# Altium schematic sheet imxbbnet.SchDoc: IMXBB
size A3; DocumentNumber: 8; Revision: 2.0; SheetNumber: 8; SheetTotal: 9
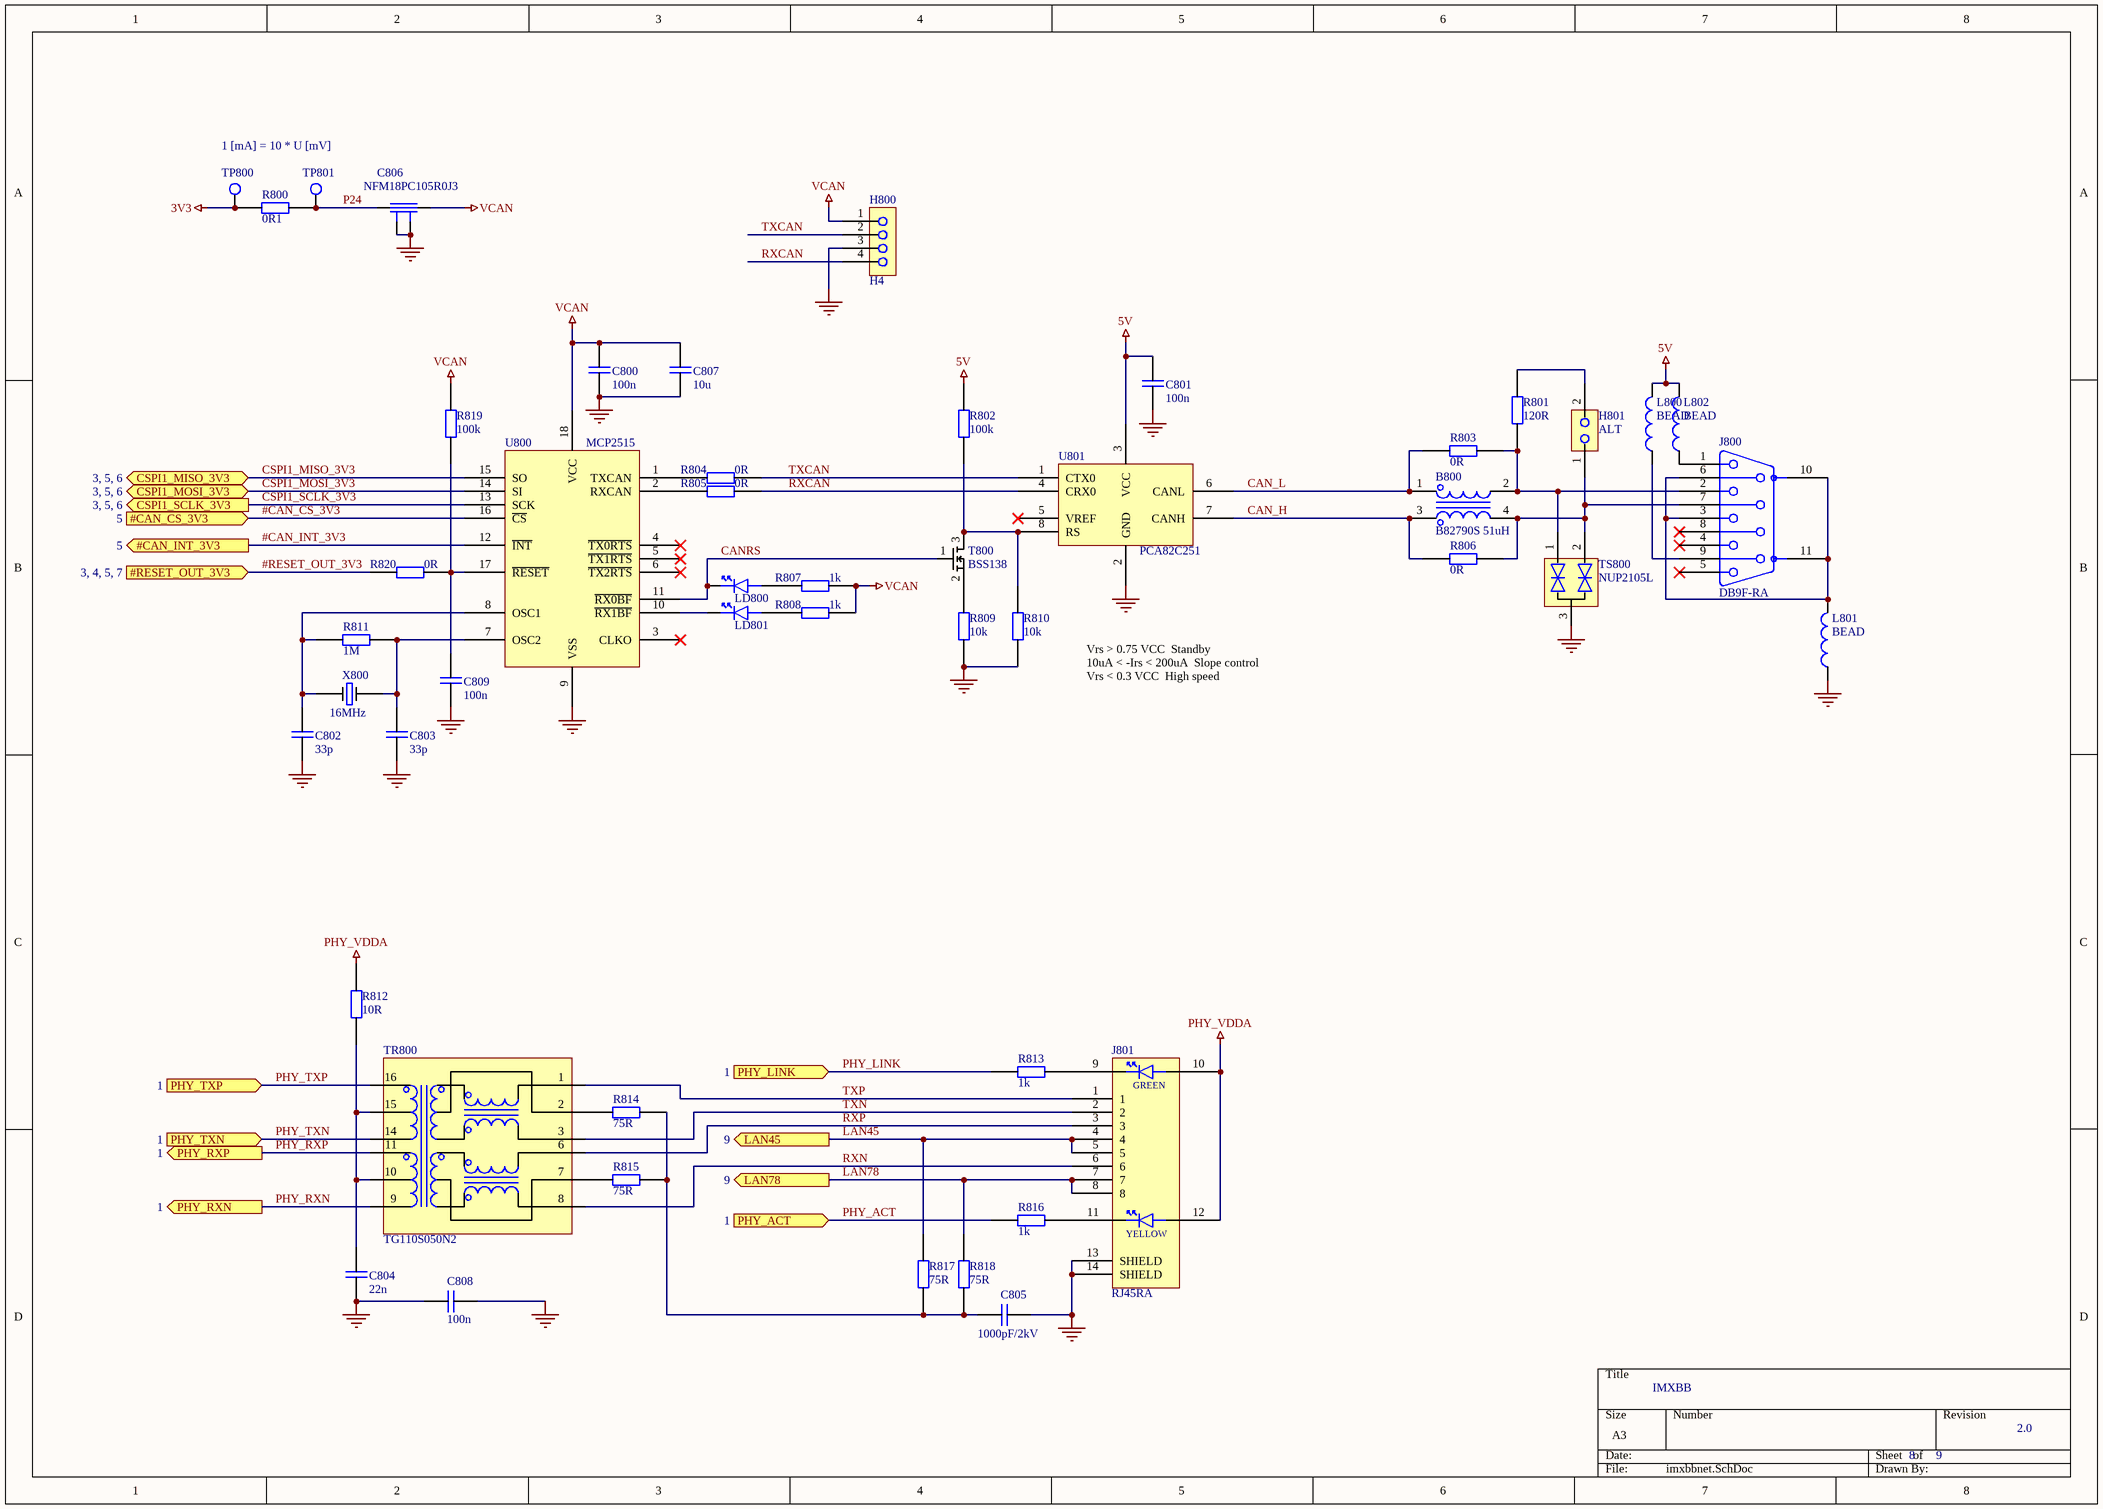
[diagram p0: imxbbnet.SchDoc]

## Parts
B800  B82790S 51uH  [B82790]
C800  100n  [0603]
C801  100n  [0603]
C802  33p  [0603]
C803  33p  [0603]
C804  22n  [0603]
C805  1000pF/2kV  [1n]
C806  NFM18PC105R0J3  [NFM18P]
C807  10u  [0805]
C808  100n  [0603]
C809  100n  [0603]
H800  H4  [H1x4]
H801  ALT  [H1x2]
J800  DB9F-RA  [DRA9_F]
J801  RJ45RA  [RJ45LED]
L800  BEAD  [0805]
L801  BEAD  [0603]
L802  BEAD  [0805]
LD800  LED  [0805]  (value not drawn)
LD801  LED  [0805]  (value not drawn)
R800  0R1  [0603]
R801  120R  [0603]
R802  100k  [0603]
R803  0R  [0603]
R804  0R  [0603]
R805  0R  [0603]
R806  0R  [0603]
R807  1k  [0603]
R808  1k  [0603]
R809  10k  [0603]
R810  10k  [0603]
R811  1M  [0603]
R812  10R  [0603]
R813  1k  [0603]
R814  75R  [0603]
R815  75R  [0603]
R816  1k  [0603]
R817  75R  [0603]
R818  75R  [0603]
R819  100k  [0603]
R820  0R  [0603]
T800  BSS138  [SOT23]
TP800  TESTPOINT  [TESTPOINT_2mm]  (value not drawn)
TP801  TESTPOINT  [TESTPOINT_2mm]  (value not drawn)
TR800  TG110S050N2  [SOIC16M]
TS800  NUP2105L  [SOT23]
U800  MCP2515  [SOIC18W]
U801  PCA82C251  [SOIC8N]
X800  16MHz  [HC494H]

## Ports
#CAN_CS_3V3 (in, see 5), #CAN_INT_3V3 (out, see 5), #RESET_OUT_3V3 (in, see 3, 4, 5, 7), CSPI1_MISO_3V3 (bidir, see 3, 5, 6), CSPI1_MOSI_3V3 (bidir, see 3, 5, 6), CSPI1_SCLK_3V3 (out, see 3, 5, 6), LAN45 (out, see 9), LAN78 (out, see 9), PHY_ACT (in, see 1), PHY_LINK (in, see 1), PHY_RXN (out, see 1), PHY_RXP (out, see 1), PHY_TXN (in, see 1), PHY_TXP (in, see 1)

## Nets
3V3: R800.1 TP800.1
5V: C801.2 L800.2 L802.2 R802.1 U801.3(VCC)
CASE_GND: C805.2 C808.1 J801.13(SHIELD) J801.14(SHIELD)
GND: C800.1 C801.1 C802.1 C803.1 C804.1 C806.2 C806.4 C807.1 C808.2 C809.1 H800.3 L801.1 R809.2 R810.2 TS800.3 U800.9(VSS) U801.2(GND)
PHY_VDDA: J801.10(D1P) J801.12(D2P) R812.2
VCAN: C800.2 C806.3 C807.2 H800.1 R807.1 R808.1 R819.1 U800.18(VCC)
#CAN_CS_3V3: U800.16(~{CS}) ; port #CAN_CS_3V3
#CAN_INT_3V3: U800.12(~{INT}) ; port #CAN_INT_3V3
#RESET_OUT_3V3: R820.2 ; port #RESET_OUT_3V3
CAN_H: B800.3 R806.1 U801.7(CANH)
CAN_L: B800.1 R803.1 U801.6(CANL)
CANRS: LD800.2(CATHODE) T800.1(G) U800.11(~{RX0BF})
CSPI1_MISO_3V3: U800.15(SO) ; port CSPI1_MISO_3V3
CSPI1_MOSI_3V3: U800.14(SI) ; port CSPI1_MOSI_3V3
CSPI1_SCLK_3V3: U800.13(SCK) ; port CSPI1_SCLK_3V3
LAN45: J801.4 J801.5 R817.2 ; port LAN45
LAN78: J801.7 J801.8 R818.2 ; port LAN78
P24: C806.1 R800.2 TP801.1
PHY_ACT: R816.1 ; port PHY_ACT
PHY_LINK: R813.1 ; port PHY_LINK
PHY_RXN: TR800.9(P10) ; port PHY_RXN
PHY_RXP: TR800.11(P12) ; port PHY_RXP
PHY_TXN: TR800.14(P14) ; port PHY_TXN
PHY_TXP: TR800.16(P16) ; port PHY_TXP
RXCAN: H800.4 R805.1 U801.4(CRX0)
RXN: J801.6 TR800.8(P8)
RXP: J801.3 TR800.6(P6)
TXCAN: H800.2 R804.1 U801.1(CTX0)
TXN: J801.2 TR800.3(P3)
TXP: J801.1 TR800.1(P1)
NetB800_2: B800.2 J800.2 R801.2 R803.2 TS800.1
NetB800_4: B800.4 H801.1 J800.7 R806.2 TS800.2
NetC802_2: C802.2 R811.2 U800.8(OSC1) X800.1
NetC803_2: C803.2 R811.1 U800.7(OSC2) X800.2
NetC804_2: C804.2 R812.1 TR800.10(P11) TR800.15(CT)
NetC805_1: C805.1 R814.2 R815.2 R817.1 R818.1
NetC809_2: C809.2 R819.2 R820.1 U800.17(~{RESET})
NetH801_2: H801.2 R801.1
NetJ800_1: J800.1 L802.1
NetJ800_3: J800.3 J800.6 J800.10(SHIELD) J800.11(SHIELD) L801.2
NetJ800_9: J800.9 L800.1
NetJ801_9: J801.9(D1N) R813.2
NetJ801_11: J801.11(D2N) R816.2
NetLD800_1: LD800.1(ANODE) R807.2
NetLD801_1: LD801.1(ANODE) R808.2
NetLD801_2: LD801.2(CATHODE) U800.10(~{RX1BF})
NetR802_2: R802.2 R810.1 T800.3(D) U801.8(RS)
NetR804_2: R804.2 U800.1(TXCAN)
NetR805_2: R805.2 U800.2(RXCAN)
NetR809_1: R809.1 T800.2(S)
NetR814_1: R814.1 TR800.2(P2)
NetR815_1: R815.1 TR800.7(P7)

Not connected (* = marked no-connect by the designer): J800 4* 5* 8*; U800 3(CLKO)* 4(~{TX0RTS})* 5(~{TX1RTS})* 6(~{TX2RTS})*; U801 5(VREF)*

## Notes on the sheet
- 1 [mA] = 10 * U [mV]
- Vrs > 0.75 VCC		Standby
  10uA < -Irs < 200uA		Slope control
  Vrs < 0.3 VCC		High speed
- (in symbol RJ45RA) GREEN; YELLOW

## Library data of the parts
B800 = B82790S: pin to pad: 3>4 4>3
C800-C805 C807-C809 = C
C806 = NFL21S: Chip EMIFIL; Producer: Murata; Order number: NFM18PC105R0J3; Component class: C; Assembly type: SMT
H801 = H2
L800-L802 = FBEAD
R800-R820 = R
TP800 TP801 = TESTPOINT: Testpoint pad; Order number: no component; Component class: TP; Producer: n/a; Assembly type: no component
X800 = XTAL